# EAGLE design slothbot_2.1 (EAGLE 9.6.2)

## Sheet 1 of 2: Logical Components
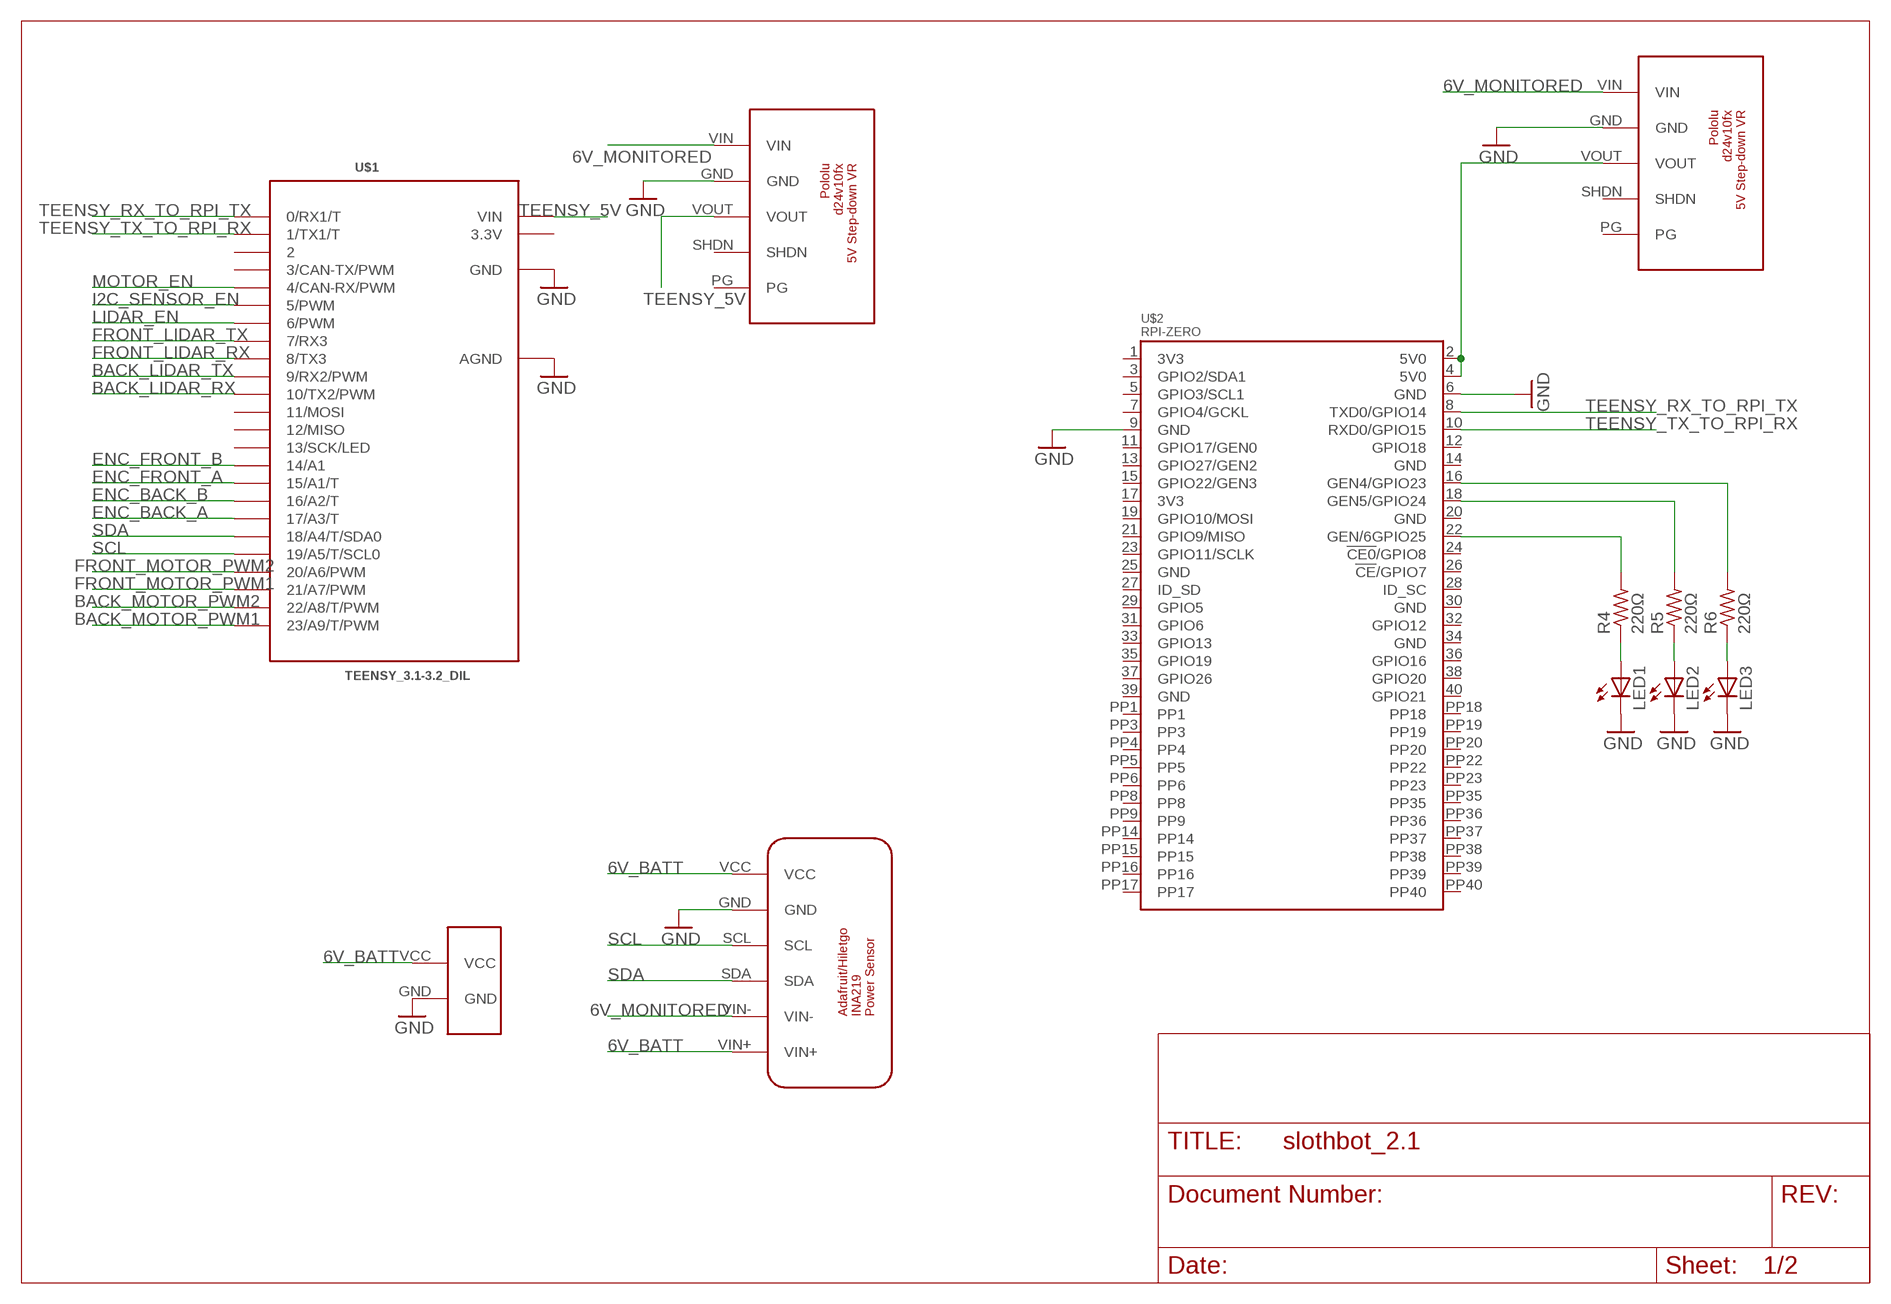
[diagram p0: schematic, sheet 1]

### Parts
LED1  LEDCHIPLED_0603  [CHIPLED_0603]
LED2  LEDCHIPLED_0603  [CHIPLED_0603]
LED3  LEDCHIPLED_0603  [CHIPLED_0603]
R4  220Ω  R-US_R3216  [R3216]
R5  220Ω  R-US_R3216  [R3216]
R6  220Ω  R-US_R3216  [R3216]
U$1  TEENSY_3.1-3.2_DIL  [TEENSY_3.0-3.2&LC_DIL]
U$2  RPI-ZERO  [RASP_PI_ZERO_BOARD_FULL]
U$12  D24V10FX  [D24V10FX]
U$13  D24V10FX  [D24V10FX]
U$15  INA219  [INA219]
U$16  BATTERY_CONNECTOR  [BATTERY_CONNECTOR]

### Nets
5V0@1: U$2.2(5V0) U$2.4(5V0) U$13.VOUT
6V_BATT: U$15.VCC U$15.VIN+ U$16.VCC
6V_MONITORED: U$12.VIN U$13.VIN U$15.VIN- ; also sheet 2
BACK_LIDAR_RX: U$1.10(10/TX2/PWM) ; also sheet 2
BACK_LIDAR_TX: U$1.9(9/RX2/PWM) ; also sheet 2
BACK_MOTOR_PWM1: U$1.23/A9(23/A9/T/PWM) ; also sheet 2
BACK_MOTOR_PWM2: U$1.22/A8(22/A8/T/PWM) ; also sheet 2
ENC_BACK_A: U$1.17/A3(17/A3/T) ; also sheet 2
ENC_BACK_B: U$1.16/A2(16/A2/T) ; also sheet 2
ENC_FRONT_A: U$1.15/A1(15/A1/T) ; also sheet 2
ENC_FRONT_B: U$1.14/A0(14/A1) ; also sheet 2
FRONT_LIDAR_RX: U$1.8(8/TX3) ; also sheet 2
FRONT_LIDAR_TX: U$1.7(7/RX3) ; also sheet 2
FRONT_MOTOR_PWM1: U$1.21/A7(21/A7/PWM) ; also sheet 2
FRONT_MOTOR_PWM2: U$1.20/A6(20/A6/PWM) ; also sheet 2
GND: LED1.C LED2.C LED3.C U$1.AGND U$1.GND U$2.6(GND) U$12.GND U$13.GND U$15.GND U$16.GND ; also sheet 2
GND@1: U$2.9(GND) ; supply symbol labelled GND
I2C_SENSOR_EN: U$1.5(5/PWM) ; also sheet 2
LIDAR_EN: U$1.6(6/PWM) ; also sheet 2
MOTOR_EN: U$1.4(4/CAN-RX/PWM) ; also sheet 2
N$6: LED1.A R4.1
N$10: LED2.A R5.1
N$11: LED3.A R6.1
N$12: R6.2 U$2.16(GEN4/GPIO23)
N$13: R5.2 U$2.18(GEN5/GPIO24)
N$14: R4.2 U$2.22(GEN/6GPIO25)
SCL: U$1.19/A5(19/A5/T/SCL0) U$15.SCL ; also sheet 2
SDA: U$1.18/A4(18/A4/T/SDA0) U$15.SDA ; also sheet 2
TEENSY_5V: U$1.VIN U$12.VOUT ; also sheet 2
TEENSY_RX_TO_RPI_TX: U$1.0(0/RX1/T) U$2.8(TXD0/GPIO14)
TEENSY_TX_TO_RPI_RX: U$1.1(1/TX1/T) U$2.10(RXD0/GPIO15)
Unconnected: U$1.2 U$1.3(3/CAN-TX/PWM) U$1.11(11/MOSI) U$1.12(12/MISO) U$1.13(13/SCK/LED) U$2.1(3V3) U$2.3(GPIO2/SDA1) U$2.5(GPIO3/SCL1) U$2.7(GPIO4/GCKL) U$2.11(GPIO17/GEN0) U$2.12(GPIO18) U$2.13(GPIO27/GEN2) U$2.14(GND) U$2.15(GPIO22/GEN3) U$2.17(3V3) U$2.19(GPIO10/MOSI) U$2.20(GND) U$2.21(GPIO9/MISO) U$2.23(GPIO11/SCLK) U$2.24(!CE0!/GPIO8) U$2.25(GND) U$2.26(!CE!/GPIO7) U$2.27(ID_SD) U$2.28(ID_SC) U$2.29(GPIO5) U$2.30(GND) U$2.31(GPIO6) U$2.32(GPIO12) U$2.33(GPIO13) U$2.34(GND) U$2.35(GPIO19) U$2.36(GPIO16) U$2.37(GPIO26) U$2.38(GPIO20) U$2.39(GND) U$2.40(GPIO21) U$2.PP1 U$2.PP3 U$2.PP4 U$2.PP5 U$2.PP6 U$2.PP8 U$2.PP9 U$2.PP14 U$2.PP15 U$2.PP16 U$2.PP17 U$2.PP18 U$2.PP19 U$2.PP20 U$2.PP22 U$2.PP23 U$2.PP35 U$2.PP36 U$2.PP37 U$2.PP38 U$2.PP39 U$2.PP40 U$12.PG U$12.SHDN U$13.PG U$13.SHDN

## Sheet 2 of 2: Sensor and motors
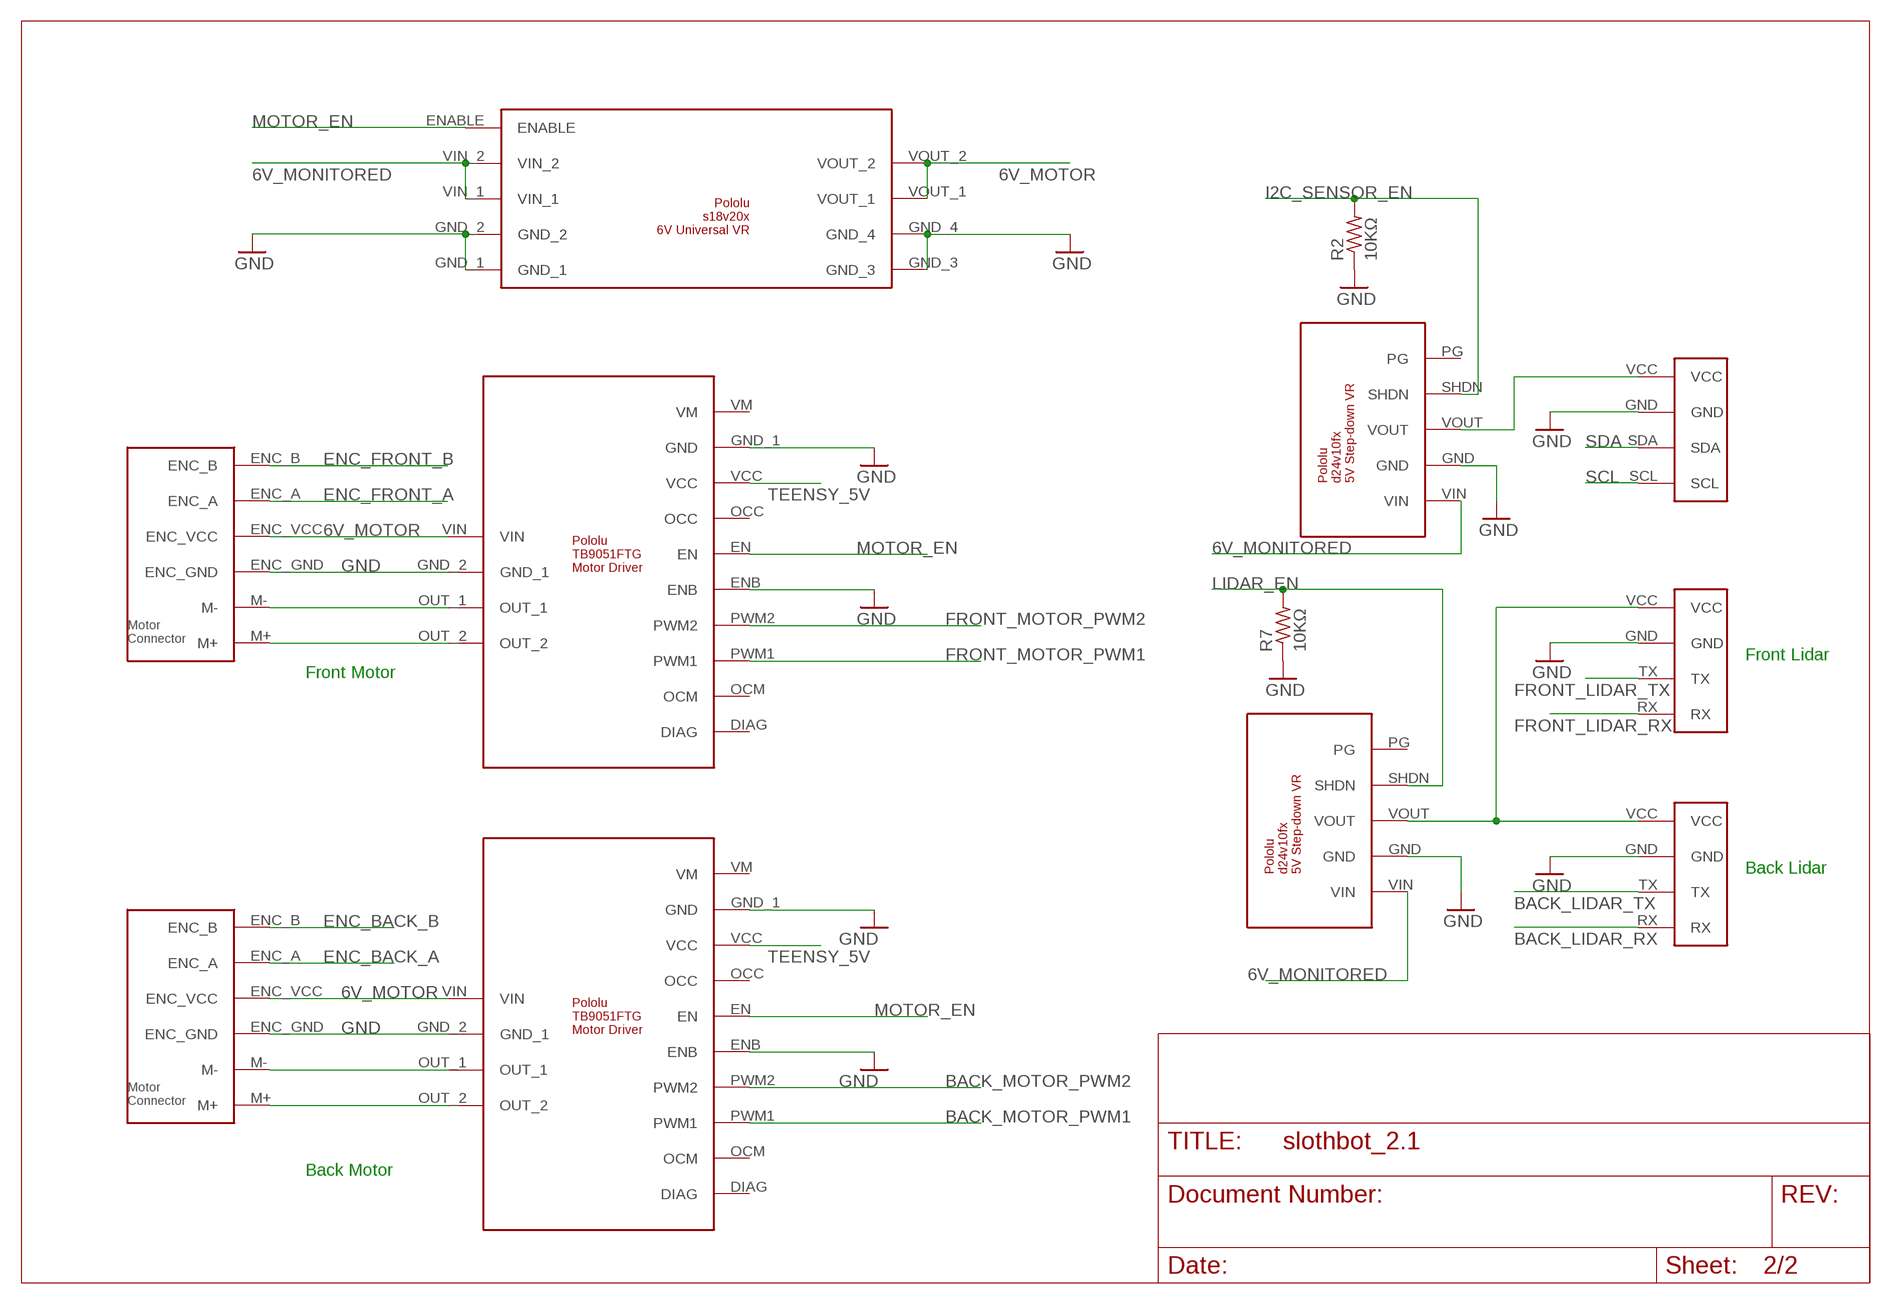
[diagram p1: schematic, sheet 2]

### Parts
R2  10KΩ  R-US_R3216  [R3216]
R7  10KΩ  R-US_R3216  [R3216]
U$3  D24V10FX  [D24V10FX]
U$4  MOTOR_CONNECTOR  [MOTOR_CONNECTOR]
U$5  MOTOR_CONNECTOR  [MOTOR_CONNECTOR]
U$6  SERIAL_CONNECTOR  [SERIAL_CONNECTOR]
U$7  SERIAL_CONNECTOR  [SERIAL_CONNECTOR]
U$8  I2C_CONNECTOR  [I2C_CONNECTOR]
U$9  TB9051FTG  [TB9051FTG]
U$10  TB9051FTG  [TB9051FTG]
U$11  S18V20X  [S18V20F6]
U$14  D24V10FX  [D24V10FX]

### Nets
6V_MONITORED: U$3.VIN U$11.VIN_1 U$11.VIN_2 U$14.VIN ; also sheet 1
6V_MOTOR: U$4.ENC_VCC U$5.ENC_VCC U$9.VIN U$10.VIN U$11.VOUT_1 U$11.VOUT_2
BACK_LIDAR_RX: U$6.RX ; also sheet 1
BACK_LIDAR_TX: U$6.TX ; also sheet 1
BACK_MOTOR_PWM1: U$10.PWM1 ; also sheet 1
BACK_MOTOR_PWM2: U$10.PWM2 ; also sheet 1
ENC_BACK_A: U$5.ENC_A ; also sheet 1
ENC_BACK_B: U$5.ENC_B ; also sheet 1
ENC_FRONT_A: U$4.ENC_A ; also sheet 1
ENC_FRONT_B: U$4.ENC_B ; also sheet 1
FRONT_LIDAR_RX: U$7.RX ; also sheet 1
FRONT_LIDAR_TX: U$7.TX ; also sheet 1
FRONT_MOTOR_PWM1: U$9.PWM1 ; also sheet 1
FRONT_MOTOR_PWM2: U$9.PWM2 ; also sheet 1
GND: R2.1 R7.1 U$3.GND U$4.ENC_GND U$5.ENC_GND U$6.GND U$7.GND U$8.GND U$9.ENB U$9.GND_1(GND) U$9.GND_2(GND_1) U$10.ENB U$10.GND_1(GND) U$10.GND_2(GND_1) U$11.GND_1 U$11.GND_2 U$11.GND_3 U$11.GND_4 U$14.GND ; also sheet 1
I2C_SENSOR_EN: R2.2 U$14.SHDN ; also sheet 1
LIDAR_EN: R7.2 U$3.SHDN ; also sheet 1
MOTOR_EN: U$9.EN U$10.EN U$11.ENABLE ; also sheet 1
N$2: U$3.VOUT U$6.VCC U$7.VCC
N$3: U$4.M- U$9.OUT_1
N$4: U$4.M+ U$9.OUT_2
N$7: U$5.M- U$10.OUT_1
N$8: U$5.M+ U$10.OUT_2
N$9: U$8.VCC U$14.VOUT
SCL: U$8.SCL ; also sheet 1
SDA: U$8.SDA ; also sheet 1
TEENSY_5V: U$9.VCC U$10.VCC ; also sheet 1
Unconnected: U$3.PG U$9.DIAG U$9.OCC U$9.OCM U$9.VM U$10.DIAG U$10.OCC U$10.OCM U$10.VM U$14.PG

### Notes on the sheet
- Front Lidar
- Front Motor
- Back Lidar
- Back Motor

## Power pins joined to a net without a drawn wire
3.3V: U$1.3.3V

## Library data of the parts
LED1-LED3 = adafruit:LED: LED OSRAM: - CHIPLED LG R971, LG N971, LY N971, LG Q971, LY Q971, LO R971, LY R971 LH N974, LH R974 LS Q976, LO Q976, LY Q976 LO Q996 - Hyper CHIPLED LW Q18S LB Q993, LB Q99A, LB R99A - SideLED LS A670, LO A670, LY A670, LG A670, LP A670 LB A673, LV A673, LT A673, LW A673 LH A674 LY A675 LS A676, LA A676, LO A676, LY A676, LW A676 LS A679, LY A679, LG A679 - Hyper Micro SIDELED® LS Y876, LA Y876, LO Y876, LY Y876 LT Y87S - SmartLED LW L88C, LW L88S LB L89C, LB L89S, LG L890 LS L89K, LO L89K, LY L89K LS L896, LA L896, LO L896, LY L896 - TOPLED LS T670, LO T670, LY T670, LG T670, LP T670 LSG T670, LSP T670, LSY T670, LOP T670, LYG T670 LG T671, LOG T671, LSG T671 LB T673, LV T673, LT T673, LW T673 LH T674 LS T676, LA T676, LO T676, LY T676, LB T676, LH T676, LSB T676, LW T676 LB T67C, LV T67C, LT T67C, LS T67K, LO T67K, LY T67K, LW E67C LS E67B, LA E67B, LO E67B, LY E67B, LB E67C, LV E67C, LT E67C LW T67C LS T679, LY T679, LG T679 LS T770, LO T770, LY T770, LG T770, LP T770 LB T773, LV T773, LT T773, LW T773 LH T774 LS E675, LA E675, LY E675, LS T675 LS T776, LA T776, LO T776, LY T776, LB T776 LHGB T686 LT T68C, LB T68C - Hyper Mini TOPLED® LB M676 - Mini TOPLED Santana® LG M470 LS M47K, LO M47K, LY M47K Source: http://www.osram.convergy.de/
R2 R4-R7 = adafruit:R-US_: RESISTOR, American symbol
U$1 = Teensy_3_and_LC_Series_Boards_v1.4:TEENSY_3.1-3.2_DIL: Teensy 3.1 or 3.2 in a DIL Layout.
U$2 = rpi-zero:RPI-ZERO
U$3 U$12-U$14 = slothbot_parts:D24V10FX
U$4 U$5 = slothbot_parts:MOTOR_CONNECTOR
U$6 U$7 = slothbot_parts:SERIAL_CONNECTOR
U$8 = slothbot_parts:I2C_CONNECTOR
U$9 U$10 = slothbot_parts:TB9051FTG
U$11 = slothbot_parts:S18V20X
U$15 = slothbot_parts:INA219
U$16 = slothbot_parts:BATTERY_CONNECTOR

## Board
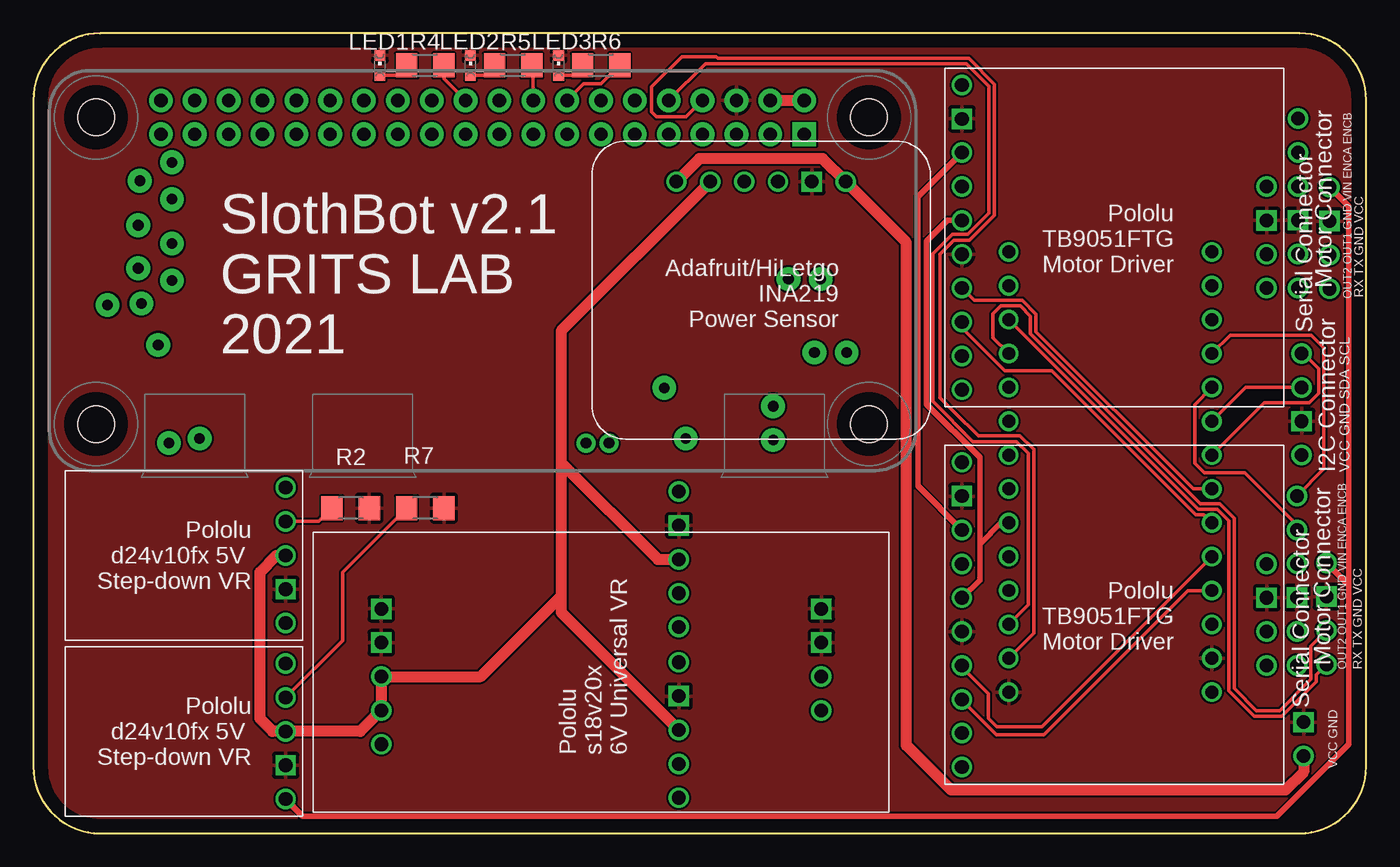
[diagram p2: board, top side]
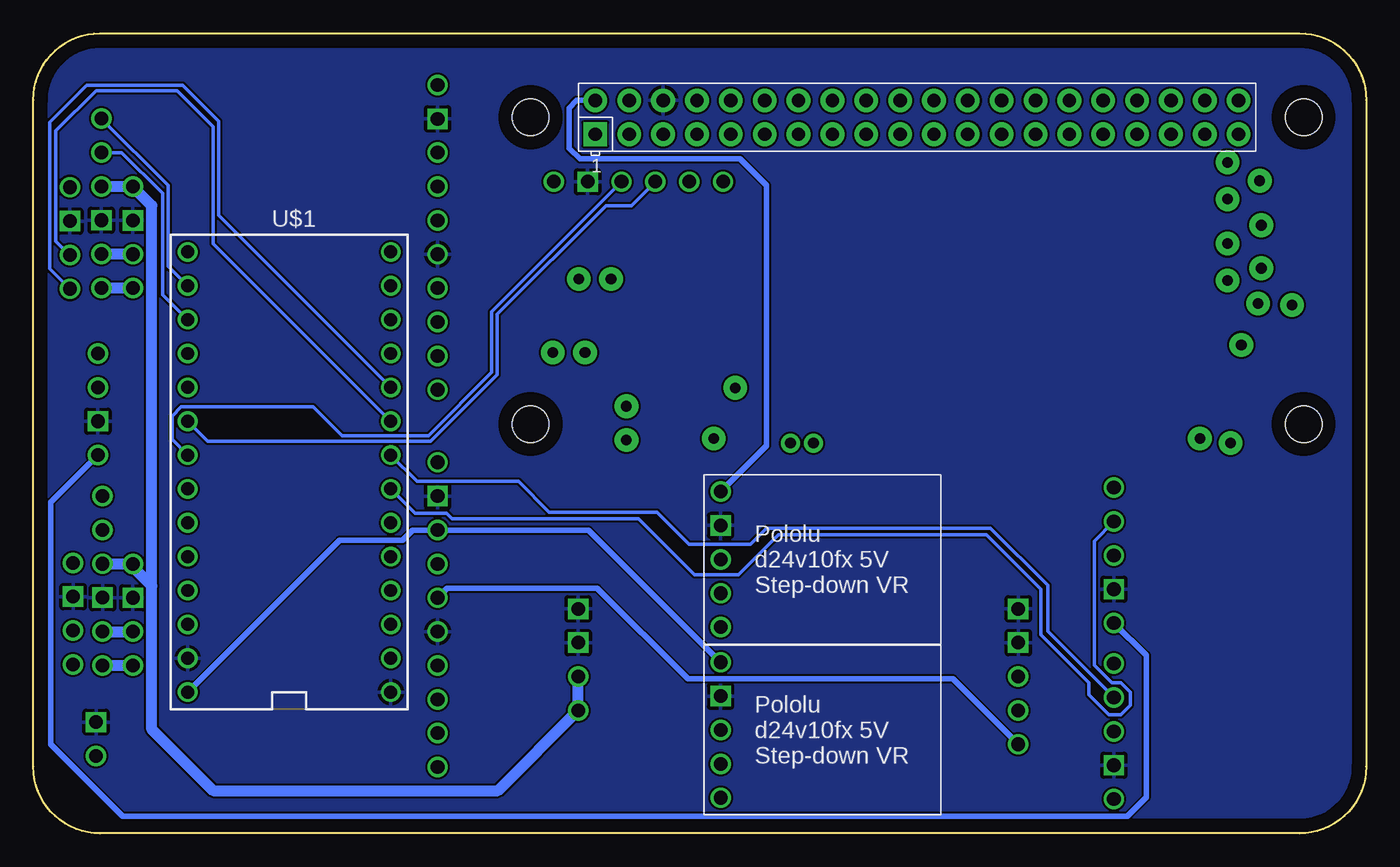
[diagram p3: board, bottom side, seen from below]

Size 100 x 60 mm. Coordinates in mm from the lower left corner, seen from the top.
Outline: 0,5 arc90 5,0 95,0 arc90 100,5 100,55 arc90 95,60 5,60 arc90 0,55 0,5
Copper layers (1*16): Top 0.035mm / dielectric 1.5mm / Bottom 0.035mm
Design rules "default": minimum track width 6mil, minimum drill 0.35mm, track to track 6mil, track to pad 6mil, pad to pad 6mil, via to via 6mil, smd to smd 6mil, copper to edge 40mil, drill to drill 6mil, minimum pad ring 10mil, minimum via ring 8mil, stop-mask expansion 4mil, vias tented up to drill 0mil, thermal gap 10mil

### Footprints (pad centres in the part's own frame; a part is rotated, then mirrored left to right if it is on the bottom)
CHIPLED_0603 = smd 0.8 x 0.8: A 0,-0.75; C 0,0.75
R3216 = smd 1.6 x 1.8: 1 -1.4,0; 2 1.4,0
TEENSY_3.0-3.2&LC_DIL = drill 0.965: 0 -7.62,13.97; 1 -7.62,11.43; 2 -7.62,8.89; 3 -7.62,6.35; 3.3V 7.62,11.43; 4 -7.62,3.81; 5 -7.62,1.27; 6 -7.62,-1.27; 7 -7.62,-3.81; 8 -7.62,-6.35; 9 -7.62,-8.89; 10 -7.62,-11.43; 11 -7.62,-13.97; 12 -7.62,-16.51; 13 7.62,-16.51; 14/A0 7.62,-13.97; 15/A1 7.62,-11.43; 16/A2 7.62,-8.89; 17/A3 7.62,-6.35; 18/A4 7.62,-3.81; 19/A5 7.62,-1.27; 20/A6 7.62,1.27; 21/A7 7.62,3.81; 22/A8 7.62,6.35; 23/A9 7.62,8.89; AGND 7.62,13.97; GND -7.62,16.51; VIN 7.62,16.51
RASP_PI_ZERO_BOARD_FULL = drill 1 pad 1.778 square: 1 8.37,25.23 | drill 1 pad 1.778: 2 8.37,27.77; 3 10.91,25.23; 4 10.91,27.77; 5 13.45,25.23; 6 13.45,27.77; 7 15.99,25.23; 8 15.99,27.77; 9 18.53,25.23; 10 18.53,27.77; 11 21.07,25.23; 12 21.07,27.77; 13 23.61,25.23; 14 23.61,27.77; 15 26.15,25.23; 16 26.15,27.77; 17 28.69,25.23; 18 28.69,27.77; 19 31.23,25.23; 20 31.23,27.77; 21 33.77,25.23; 22 33.77,27.77; 23 36.31,25.23; 24 36.31,27.77; 25 38.85,25.23; 26 38.85,27.77; 27 41.39,25.23; 28 41.39,27.77; 29 43.93,25.23; 30 43.93,27.77; 31 46.47,25.23; 32 46.47,27.77; 33 49.01,25.23; 34 49.01,27.77; 35 51.55,25.23; 36 51.55,27.77; 37 54.09,25.23; 38 54.09,27.77; 39 56.63,25.23; 40 56.63,27.77 | drill 0.8 pad 1.778: PP1 10.699,4.832; PP3 7.593,8.858; PP4 7.133,14.38; PP5 55.796,23.124; PP6 10.699,2.301; PP8 5.177,8.858; PP9 9.549,14.38; PP14 58.327,18.407; PP15 55.796,14.265; PP16 55.796,20.363; PP17 58.212,21.743; PP18 55.796,17.027; PP19 58.327,15.186; PP20 56.832,9.434; PP35 17.257,2.416; PP36 60.628,12.425; PP37 56.026,2.071; PP38 53.726,2.416; PP39 58.097,12.54; PP40 18.867,6.212 | drill 0.8 pad 1.422: PP22 23.009,2.071; PP23 24.734,2.071 | hole 2.75: 3.5,3.5; 3.5,26.5; 61.5,3.5; 61.5,26.5
D24V10FX = drill 1.02 square: GND 1.27,8.89 | drill 1.02: PG 1.27,1.27; SHDN 1.27,3.81; VIN 1.27,6.35; VOUT 1.27,11.43
MOTOR_CONNECTOR = drill 1.02: ENC_A 10.16,0; ENC_B 12.7,0; ENC_VCC 7.62,0; M+ 0,0; M- 2.54,0 | drill 1.02 square: ENC_GND 5.08,0
SERIAL_CONNECTOR = drill 1.02 square: GND 2.54,0 | drill 1.02: RX 7.62,0; TX 5.08,0; VCC 0,0
I2C_CONNECTOR = drill 1.02 square: GND 2.54,0 | drill 1.02: SCL 7.62,0; SDA 5.08,0; VCC 0,0
TB9051FTG = drill 1.02: DIAG 24.13,24.13; EN 24.13,11.43; ENB 24.13,13.97; OCC 24.13,8.89; OCM 24.13,21.59; OUT_1 1.27,13.97; OUT_2 1.27,16.51; PWM1 24.13,19.05; PWM2 24.13,16.51; VCC 24.13,6.35; VIN 1.27,8.89; VM 24.13,1.27 | drill 1.02 square: GND_1 1.27,11.43; GND_2 24.13,3.81
S18V20F6 = drill 1.02: ENABLE 5.08,38.1; VIN_1 10.16,38.1; VIN_2 7.62,38.1; VOUT_1 10.16,5.08; VOUT_2 7.62,5.08 | drill 1.02 square: GND_1 15.24,38.1; GND_2 12.7,38.1; GND_3 15.24,5.08; GND_4 12.7,5.08
INA219 = drill 1.016 square: GND -3.81,-17.272 | drill 1.016: SCL -1.27,-17.272; SDA 1.27,-17.272; VCC -6.35,-17.272; VIN+ 6.35,-17.272; VIN- 3.81,-17.272
BATTERY_CONNECTOR = drill 1 square: GND 2.54,0 | drill 1: VCC 0,0

### Placement (x,y rotation side)
LED1  26,57.6 0 top
LED2  32.8,57.6 0 top
LED3  39.4,57.6 0 top
R2  23.8,24.4 180 top
R4  29.4,57.6 0 top
R5  36,57.6 0 top
R6  42.6,57.6 0 top
R7  29.4,24.4 180 top
U$1  80.8,27.1 180 bottom
U$2  66.2,27.2 0 bottom
U$3  20.2,14 180 top
U$4  94.9,40.9 90 top
U$5  94.8,12.6 90 top
U$6  97.02,20.29 270 top
U$7  97.26,48.46 270 top
U$8  95.16,28.37 90 top
U$9  93.8,57.4 180 top
U$10  93.8,29.1 180 top
U$11  64.2,1.6 90 top
U$12  49.7,1.4 0 bottom
U$13  49.7,14.2 0 bottom
U$14  20.2,27.2 180 top
U$15  54.6,31.6 180 top
U$16  95.3,5.8 90 top

### Tracks (layer width: path | path; a pad name or v marks a point on that pad's centre or on a via)
5V0@1
  Top 0.813: U$2.4 U$2.2
  Bottom 0.406: U$2.2 59.23,54.97 59.8,54.4 59.8,51.4 59,50.6 47,50.6 45,48.6 45,29.06 U$13.VOUT
6V_BATT
  Top 0.813: U$16.VCC 95.3,4.59 93.94,3.23 68.87,3.23 65.5,6.6 65.5,44.32 U$15.VCC 59.22,50.6 49.98,50.6 U$15.VIN+
6V_MONITORED
  Top 0.813: U$15.VIN- 39.6,37.68 39.6,27.8 | 39.6,27.8 46.85,20.55 U$13.VIN | 39.6,27.8 39.6,17.8 | 39.6,17.8 39.6,16.58 U$12.VIN | 39.6,17.8 33.56,11.76 U$11.VIN_1 U$11.VIN_2 24.53,7.65 U$3.VIN 17.95,7.65 17,8.6 17,19.6 18.25,20.85 U$14.VIN
6V_MOTOR
  Bottom 0.813: U$4.ENC_VCC U$9.VIN 91.11,47.09 91.11,18.57 | U$5.ENC_VCC U$10.VIN 92.53,19.99 91.11,18.57 | 91.11,18.57 91.11,7.81 86.5,3.2 65.14,3.2 U$11.VOUT_2 U$11.VOUT_1
BACK_LIDAR_RX
  Top 0.254: U$6.RX 96.25,11.9 96.25,11.38 93.67,8.8 91.6,8.8 89.7,10.7 89.7,23.45 88.84,24.31 87.4,24.31 U$1.10
BACK_LIDAR_TX
  Top 0.254: U$6.TX 95.84,14.03 95.84,11.54 93.51,9.21 91.77,9.21 90.11,10.87 90.11,23.61 89.01,24.71 87.57,24.71 74.8,37.48 74.8,38.8 74.04,39.56 72.6,39.56 72,38.96 72,37.17 U$1.9
BACK_MOTOR_PWM1
  Top 0.254: U$10.PWM1 69.67,9.99 72.26,7.4 75.81,7.4 86.62,18.21 U$1.23/A9
BACK_MOTOR_PWM2
  Top 0.254: U$10.PWM2 69.67,12.46 71.66,10.47 71.66,8.63 72.3,8 75.67,8 U$1.22/A8
ENC_BACK_A
  Top 0.254: U$1.17/A3 87.13,32.16 87.13,27.75 87.84,27.04 90.9,27.04 94.8,23.14 U$5.ENC_A
ENC_BACK_B
  Top 0.254: U$1.16/A2 89.79,37.36 95.89,37.36 96.84,36.41 96.84,27.34 U$5.ENC_B
ENC_FRONT_A
  Bottom 0.254: U$4.ENC_A 93.36,51.06 90.3,48 90.3,40.41 U$1.15/A1
ENC_FRONT_B
  Bottom 0.254: U$4.ENC_B 89.89,48.59 89.89,42.54 U$1.14/A0
FRONT_LIDAR_RX
  Bottom 0.254: U$7.RX 98.78,42.36 98.78,53.32 96,56.1 88.8,56.1 86.1,53.4 86.1,46.37 U$1.8
FRONT_LIDAR_TX
  Bottom 0.254: U$1.7 86.51,44.24 86.51,53 89.2,55.69 95.3,55.69 98.3,52.69 98.3,44.42 U$7.TX
FRONT_MOTOR_PWM1
  Top 0.254: U$9.PWM1 69.67,37.93 72.9,34.7 76.44,34.7 87.24,23.9 87.81,23.9 U$1.21/A7
FRONT_MOTOR_PWM2
  Top 0.254: U$9.PWM2 70.59,39.97 74.21,39.97 75.23,38.95 75.23,37.63 87.03,25.83 U$1.20/A6
GND
  pour Top: -3.81,114.3 -19.05,99.06 -19.05,97.79 -19.05,8.89 6.35,-16.51 158.75,-16.51 177.8,2.54 177.8,92.71 158.75,111.76 156.21,114.3
  pour Bottom: -3.81,105.41 -10.16,99.06 -10.16,11.43 -10.16,3.81 7.62,-13.97 154.94,-13.97 172.72,3.81 172.72,91.44 171.45,92.71 154.94,109.22 152.4,109.22 0,109.22
I2C_SENSOR_EN
  Top 0.254: U$14.SHDN 21.39,23.39 R2.2
  Bottom 0.254: U$14.SHDN 20.4,21.92 20.4,12.6 19.1,11.3 18.4,11.3 17.7,10.6 17.7,9.6 18.4,8.9 19.3,8.9 20.8,10.4 20.8,10.9 20.8,11 20.8,11.3 24.4,14.9 24.4,18.3 28.5,22.4 44.1,22.4 47.1,19.4 50.4,19.4 54.6,23.6 68.6,23.6 69,24 71.35,24 U$1.5
LIDAR_EN
  Top 0.254: R7.2 23.2,19.6 23.2,14.46 U$3.SHDN
  Bottom 0.254: U$3.SHDN 23.9,15.16 23.9,18.6 28.2,22.9 45,22.9 46.2,21.7 50.8,21.7 53.2,24.1 61.3,24.1 63.6,26.4 71.21,26.4 U$1.6
MOTOR_EN
  Top 0.406: U$10.EN 71,19 71,21.7 | 71,21.7 72.59,23.29 U$1.4 | 71,21.7 71,28.2 67,32.2 67,44.4 68.57,45.97 U$9.EN
  Bottom 0.406: U$11.ENABLE 31.02,11.6 50.9,11.6 57.7,18.4 68.94,18.4 U$10.EN
N$2
  Top 0.406: U$3.VOUT 20.2,1.29 93.3,1.29 98.7,6.7 98.7,18.61 | 98.7,18.61 U$6.VCC | 98.7,18.61 98.7,47.02 U$7.VCC
N$3
  Bottom 0.813: U$9.OUT_1 U$4.M-
N$4
  Bottom 0.813: U$9.OUT_2 U$4.M+
N$6
  Top 0.254: R4.1 27.25,56.85 LED1.A
N$7
  Bottom 0.813: U$5.M- U$10.OUT_1
N$8
  Bottom 0.813: U$5.M+ U$10.OUT_2
N$9
  Bottom 0.406: U$14.VOUT 16.5,13.34 16.5,2.7 17.91,1.29 93.3,1.29 98.7,6.7 98.7,24.83 U$8.VCC
N$10
  Top 0.254: R5.1 33.85,56.85 LED2.A
N$11
  Top 0.254: R6.1 40.45,56.85 LED3.A
N$12
  Top 0.254: U$2.16 41.28,56.2 42.6,56.2 R6.2
N$13
  Top 0.254: U$2.18 37.51,57.49 R5.2
N$14
  Top 0.254: U$2.22 30.8,56.6 R4.2
SCL
  Top 0.254: U$1.19/A5 92.35,32.3 95.74,32.3 96.43,32.99 96.43,34.85 95.29,35.99 U$8.SCL
  Bottom 0.254: U$15.SCL 65.61,39.14 65.61,34.57 70.36,29.82 76.82,29.82 79,32 88.9,32 89.6,31.3 89.6,29.55 U$1.19/A5
SDA
  Top 0.254: U$1.18/A4 90.96,33.45 U$8.SDA
  Bottom 0.254: U$15.SDA 55.13,47.07 57.05,47.07 65.2,38.92 65.2,34.4 70.19,29.41 86.92,29.41 U$1.18/A4
TEENSY_5V
  Top 0.406: U$9.VCC 66.36,47.74 66.36,26.06 U$10.VCC
  Bottom 0.406: U$12.VOUT 58.35,22.75 U$10.VCC 71.55,22.75 72.3,22 77.01,22 U$1.VIN
TEENSY_RX_TO_RPI_TX
  Top 0.254: U$1.0 75.06,15.01 75.06,28.79 74.03,29.82 70.89,29.82 70.07,30.64 69.94,30.77 68.04,32.67 68.04,43.43 69.08,44.47 70.23,44.47 72.11,46.35 72.11,56.2 70.18,58.13 51.35,58.13 51.22,58.26 48.67,58.26 46.39,55.98 46.39,54.12 46.75,53.76 48.95,53.76 50.16,54.97 U$2.8
TEENSY_TX_TO_RPI_RX
  Top 0.254: U$1.1 74.65,17.14 74.65,28.49 73.76,29.39 70.5,29.39 67.48,32.4 67.48,43.45 68.96,44.93 70.1,44.93 71.7,46.52 71.7,56.03 70.01,57.72 50.42,57.72 U$2.10

### Text on the board
tNames: OUT2 OUT1 GND VIN ENCA ENCB | RX TX GND VCC | SlothBot v2.1 / GRITS LAB / 2021 | VCC GND SDA SCL | OUT2 OUT1 GND VIN ENCA ENCB | RX TX GND VCC | VCC GND
Text: RX TX GND VCC